# EAGLE design 140311_AriloTX_REV2_0_0 (EAGLE 6.4)
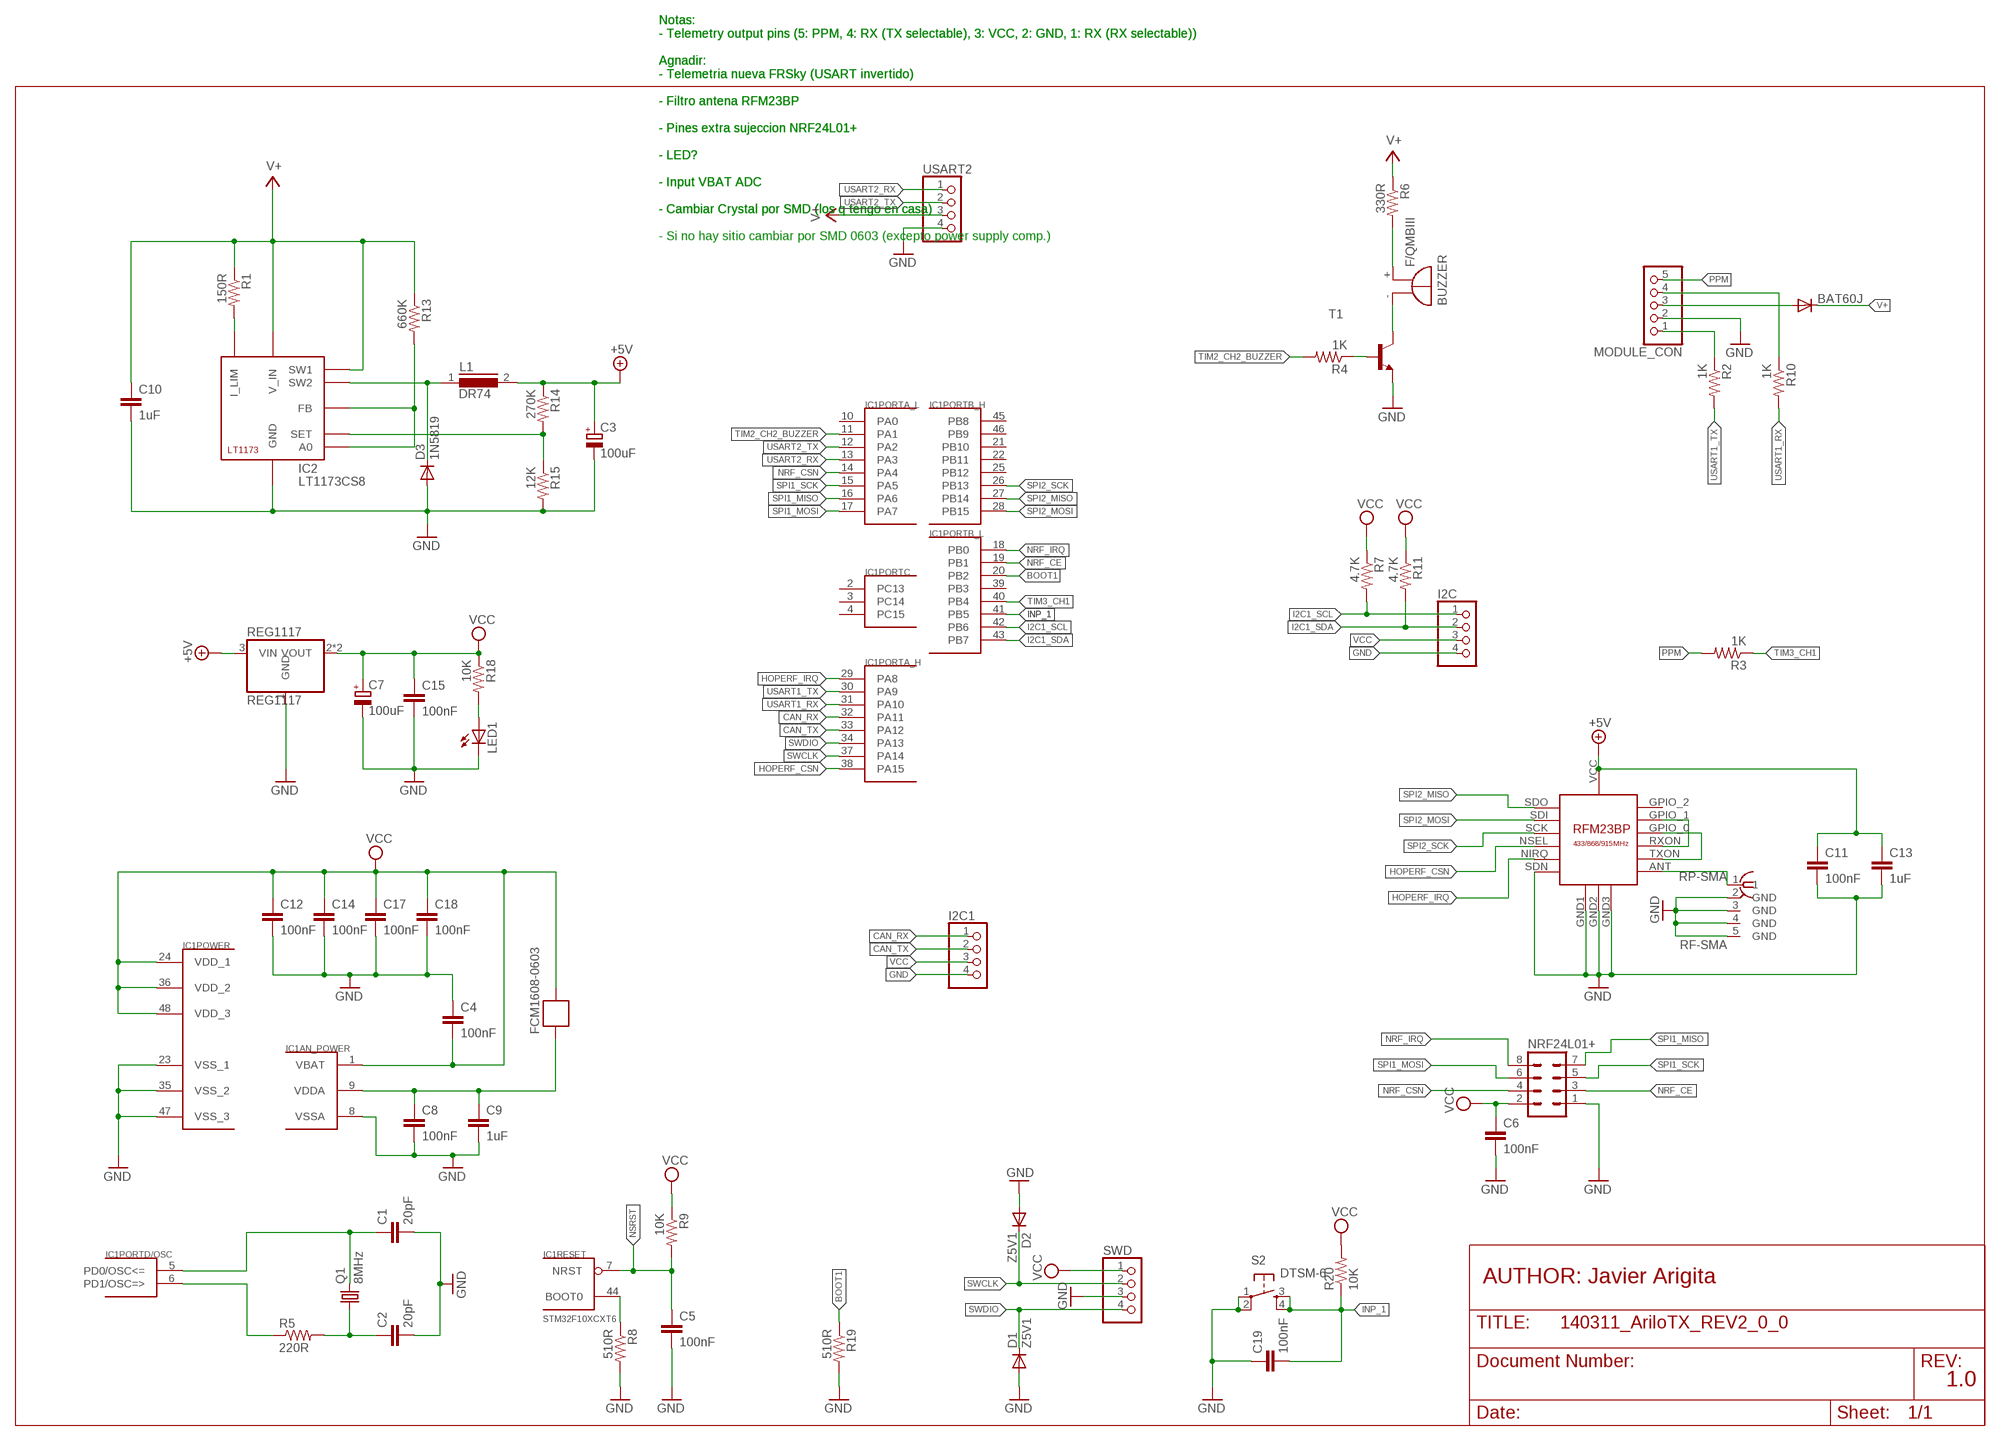
[diagram p0: schematic, sheet 1]

## Parts
BAT60J  DIODE-SOD323-R  [SOD323-R]
BUZZER  F/QMBIII  [F/QMBIII]
C1  20pF  C-EUC0805  [C0805]
C2  20pF  C-EUC0805  [C0805]
C3  100uF  CPOL-EUSMCB  [SMC_B]
C4  100nF  C-EUC0805  [C0805]
C5  100nF  C-EUC0805  [C0805]
C6  100nF  C-EUC0805  [C0805]
C7  100uF  CPOL-EUSMCB  [SMC_B]
C8  100nF  C-EUC0805  [C0805]
C9  1uF  C-EUC3216  [C3216]
C10  1uF  C-EUC3216  [C3216]
C11  100nF  C-EUC0805  [C0805]
C12  100nF  C-EUC0805  [C0805]
C13  1uF  C-EUC3216  [C3216]
C14  100nF  C-EUC0805  [C0805]
C15  100nF  C-EUC0805  [C0805]
C17  100nF  C-EUC0805  [C0805]
C18  100nF  C-EUC0805  [C0805]
C19  100nF  C-EUC0805  [C0805]
D1  Z5V1  DIODE-SOD323-R  [SOD323-R]
D2  Z5V1  DIODE-SOD323-R  [SOD323-R]
D3  1N5819  DIODE-DO214AC  [DO214AC]
FCM1608-0603  FERRITE-BEAD  [R0603]
I2C  PINHD-1X4  [1X04]
I2C1  PINHD-1X4  [1X04]
IC1  STM32F10XCXT6  [TQFP48]
IC2  LT1173CS8  [SOIC8]
L1  DR74  [DR74]
LED1  LED0805  [CHIPLED_0805]
MODULE_CON  PINHD-1X5  [1X05]
NRF24L01+  MA04-2  [MA04-2]
Q1  8MHz  CRYSTALSM49  [SM49]
R1  150R  RESISTOR0805  [R0805]
R2  1K  RESISTOR0805  [R0805]
R3  1K  RESISTOR0805  [R0805]
R4  1K  RESISTOR0805  [R0805]
R5  220R  RESISTOR0805  [R0805]
R6  330R  RESISTOR0805  [R0805]
R7  4.7K  RESISTOR0805  [R0805]
R8  510R  RESISTOR0805  [R0805]
R9  10K  RESISTOR0805  [R0805]
R10  1K  RESISTOR0805  [R0805]
R11  4.7K  RESISTOR0805  [R0805]
R13  660K  RESISTOR0805  [R0805]
R14  270K  RESISTOR0805  [R0805]
R15  12K  RESISTOR0805  [R0805]
R18  10K  RESISTOR0805  [R0805]
R19  510R  RESISTOR0805  [R0805]
R20  10K  RESISTOR0805  [R0805]
REG1117  REG1117  [SOT223]
RP-SMA  RF-SMA  [BU-SMA-H]
S2  DTSM-6  [DTSM-6]
SWD  PINHD-1X4  [1X04]
T1  BC848-NPN-SOT23-BEC  [SOT23-BEC]
U$1  RFM23BP  [RFM23BP]
USART2  PINHD-1X4  [1X04]

## Nets
+5V: C3.+ C11.1 C13.1 L1.2 R14.1 REG1117.3(VIN) U$1.VCC
BOOT1: IC1.20(PORTB_L:PB2) R19.1
CAN_RX: I2C1.1 IC1.32(PORTA_H:PA11)
CAN_TX: I2C1.2 IC1.33(PORTA_H:PA12)
GND: C1.2 C2.2 C3.- C4.1 C5.2 C6.2 C7.- C8.2 C9.2 C10.2 C11.2 C12.2 C13.2 C14.2 C15.2 C17.2 C18.2 C19.1 D1.A D2.A D3.A I2C1.4 I2C.4 IC1.8(AN_POWER:VSSA) IC1.23(POWER:VSS_1) IC1.35(POWER:VSS_2) IC1.47(POWER:VSS_3) IC2.5(GND) LED1.C MODULE_CON.2 NRF24L01+.1 R8.2 R15.2 R19.2 REG1117.1(GND) RP-SMA.2(GND) RP-SMA.3(GND) RP-SMA.4(GND) RP-SMA.5(GND) S2.1 S2.2 SWD.3 T1.E U$1.GND1 U$1.GND2 U$1.GND3 U$1.SDN USART2.4
HOPERF_CSN: IC1.38(PORTA_H:PA15) U$1.NSEL
HOPERF_IRQ: IC1.29(PORTA_H:PA8) U$1.NIRQ
I2C1_SCL: I2C.1 IC1.42(PORTB_L:PB6) R7.2
I2C1_SDA: I2C.2 IC1.43(PORTB_L:PB7) R11.2
INP_1: C19.2 IC1.41(PORTB_L:PB5) R20.1 S2.3 S2.4
N$1: C1.1 IC1.5(PORTD/OSC:PD0/OSC<=) Q1.2
N$2: IC1.6(PORTD/OSC:PD1/OSC=>) R5.1
N$3: C2.1 Q1.1 R5.2
N$4: IC1.44(RESET:BOOT0) R8.1
N$6: MODULE_CON.1 R2.1
N$9: MODULE_CON.4 R10.1
N$10: LED1.A R18.2
N$14: BAT60J.A MODULE_CON.3
N$16: BUZZER.+(-) R6.2
N$17: C8.1 C9.1 FCM1608-0603.2 IC1.9(AN_POWER:VDDA)
N$20: RP-SMA.1 U$1.ANT
N$21: R4.1 T1.B
N$23: BUZZER.-(+) T1.C
N$25: U$1.GPIO_1 U$1.RXON
N$26: U$1.GPIO_0 U$1.TXON
N$28: IC2.1(I_LIM) R1.2
N$29: IC2.6(A0) IC2.8(FB) R13.2
N$31: D3.C IC2.4(SW2) L1.1
N$32: IC2.7(SET) R14.2 R15.1
NRF_CE: IC1.19(PORTB_L:PB1) NRF24L01+.3
NRF_CSN: IC1.14(PORTA_L:PA4) NRF24L01+.4
NRF_IRQ: IC1.18(PORTB_L:PB0) NRF24L01+.8
NSRST: C5.1 IC1.7(RESET:NRST) R9.2
PPM: MODULE_CON.5 R3.2
SPI1_MISO: IC1.16(PORTA_L:PA6) NRF24L01+.7
SPI1_MOSI: IC1.17(PORTA_L:PA7) NRF24L01+.6
SPI1_SCK: IC1.15(PORTA_L:PA5) NRF24L01+.5
SPI2_MISO: IC1.27(PORTB_H:PB14) U$1.SDO
SPI2_MOSI: IC1.28(PORTB_H:PB15) U$1.SDI
SPI2_SCK: IC1.26(PORTB_H:PB13) U$1.SCK
SWCLK: D2.C IC1.37(PORTA_H:PA14) SWD.2
SWDIO: D1.C IC1.34(PORTA_H:PA13) SWD.4
TIM2_CH2_BUZZER: IC1.11(PORTA_L:PA1) R4.2
TIM3_CH1: IC1.40(PORTB_L:PB4) R3.1
USART1_RX: IC1.31(PORTA_H:PA10) R10.2
USART1_TX: IC1.30(PORTA_H:PA9) R2.2
USART2_RX: IC1.13(PORTA_L:PA3) USART2.1
USART2_TX: IC1.12(PORTA_L:PA2) USART2.2
V+: BAT60J.C C10.1 IC2.2(V_IN) IC2.3(SW1) R1.1 R6.1 R13.1 USART2.3
VCC: C4.2 C6.1 C7.+ C12.1 C14.1 C15.1 C17.1 C18.1 FCM1608-0603.1 I2C1.3 I2C.3 IC1.1(AN_POWER:VBAT) IC1.24(POWER:VDD_1) IC1.36(POWER:VDD_2) IC1.48(POWER:VDD_3) NRF24L01+.2 R7.1 R9.1 R11.1 R18.1 R20.2 REG1117.2(VOUT) REG1117.4(VOUT) SWD.1
Unconnected: IC1.2(PORTC:PC13) IC1.3(PORTC:PC14) IC1.4(PORTC:PC15) IC1.10(PORTA_L:PA0) IC1.21(PORTB_H:PB10) IC1.22(PORTB_H:PB11) IC1.25(PORTB_H:PB12) IC1.39(PORTB_L:PB3) IC1.45(PORTB_H:PB8) IC1.46(PORTB_H:PB9) U$1.GPIO_2

## Notes on the sheet
- Notas:
  - Telemetry output pins (5: PPM, 4: RX (TX selectable), 3: VCC, 2: GND, 1: RX (RX selectable))
  
  Agnadir:
  - Telemetria nueva FRSky (USART invertido)
  
  - Filtro antena RFM23BP
  
  - Pines extra sujeccion NRF24L01+
  
  - LED?
  
  - Input VBAT ADC
  
  - Cambiar Crystal por SMD (los q tengo en casa)
  
  - Si no hay sitio cambiar por SMD 0603 (excepto power supply comp.)
- Notas:
  - Telemetry output pins (5: PPM, 4: RX (TX selectable), 3: VCC, 2: GND, 1: RX (RX selectable))
  
  Agnadir:
  - Telemetria nueva FRSky (USART invertido)
  
  - Filtro antena RFM23BP
  
  - Pines extra sujeccion NRF24L01+
  
  - LED?
  
  - Input VBAT ADC
  
  - Cambiar Crystal por SMD (los q tengo en casa)
- AUTHOR: Javier Arigita
- 1.0

## Library data of the parts
BAT60J D1-D3 = diode:DIODE-: DIODE
BUZZER = buzzer:F/QMBIII: BUZZER Source: Buerklin; OC_FARNELL: unknown; OC_NEWARK: unknown
C1 C2 C4-C6 C8 C11 C12 C14 C15 C17-C19 = rcl:C-EU: CAPACITOR, European symbol
C3 C7 = rcl:CPOL-EU: POLARIZED CAPACITOR, European symbol
C9 C10 C13 = resistor:C-EU: CAPACITOR, European symbol
FCM1608-0603 = BaseApp:FERRITE-BEAD
I2C I2C1 SWD USART2 = pinhead:PINHD-1X4: PIN HEADER
IC1 = stm32:STM32F10XCXT6: ST STM32F101/103 48pin LQFP
IC2 = ltc_swr:LT1173: LT1173 - Micropower DC/DC Converter Adjustable and Fixed 5V, 12V Operates at Supply Voltages From 2.0V to 30V Consumes Only 110µA Supply Current Works in Step-Up or Step-Down Mode Only Three External Components Required Low Battery Detector Comparator On-Chip User-Adjustable Current Limit Internal 1A Power Switch Fixed or Adjustable Output Voltage Versions Space Saving 8-Pin MiniDIP or SO8 Package
L1 = inductors:DR74: High Power Density, High Efficiency, Shielded Inductors Source: coiltronics_dr_series.pdf
LED1 = CEDT:LED
MODULE_CON = pinhead:PINHD-1X5: PIN HEADER
NRF24L01+ = con-lstb:MA04-2: PIN HEADER; OC_FARNELL: unknown; OC_NEWARK: unknown
Q1 = crystal:CRYSTAL: CRYSTAL; OC_FARNELL: unknown; OC_NEWARK: unknown
R1-R11 R13-R15 R18-R20 = CEDT:RESISTOR
REG1117 = CEDT:REG1117: 800mA and 1A Low Dropout (LDO) Positive Regulator 1.8V, 2.5V, 2.85V, 3.3V, 5V, and Adj
RP-SMA = BaseApp:RF-SMA
S2 = switch-tact:DTSM-6
T1 = transistor:*-NPN-: NPN Transistror BF959 corrected 2008.03.06
U$1 = RFM23BP:RFM23BP: HopeRF RFM23BP Library by: http://projects.weber-itam.de

## Board
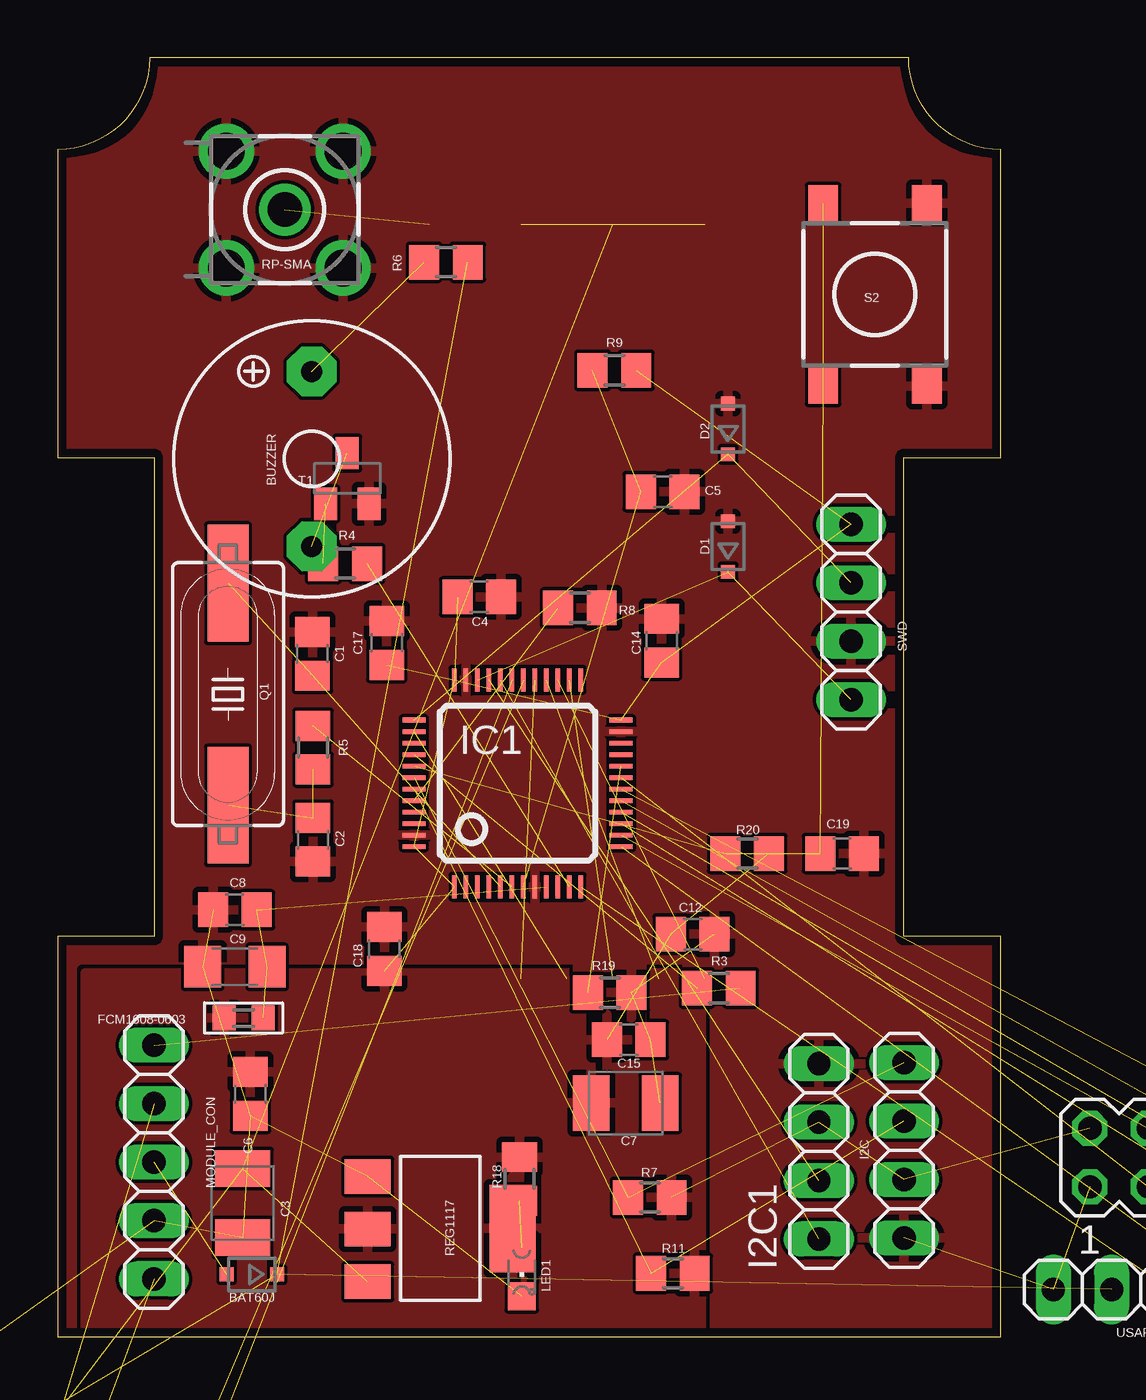
[diagram p1: board, top side]
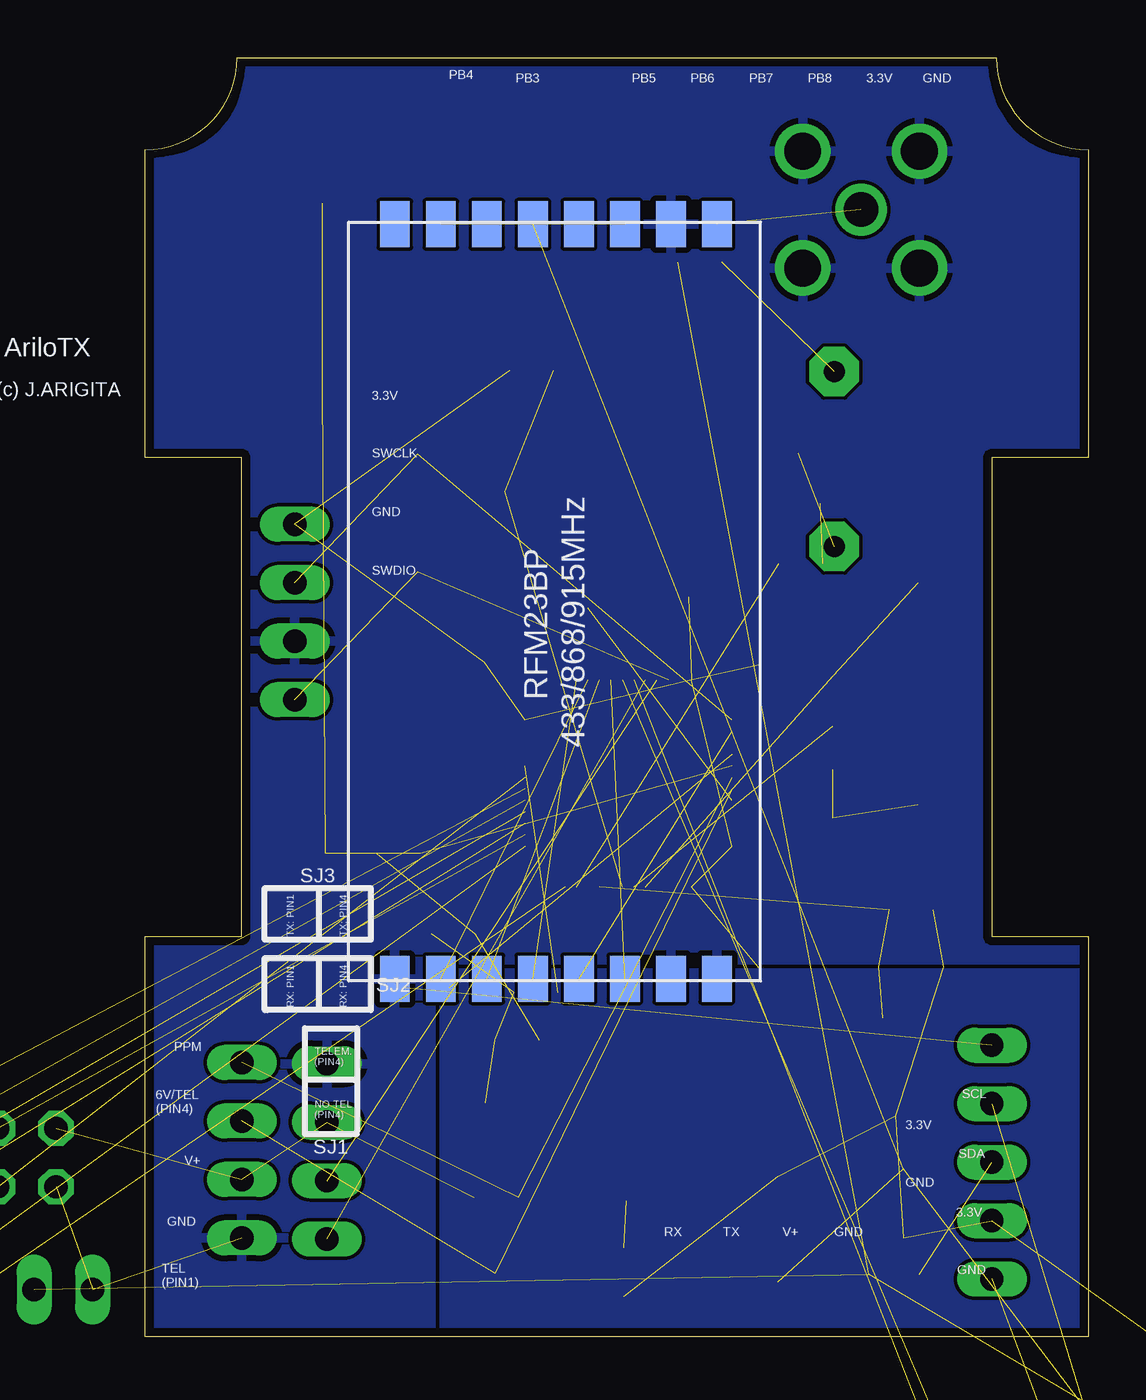
[diagram p2: board, bottom side, seen from below]

Size 41 x 55.6 mm. Coordinates in mm from the lower left corner, seen from the top.
Outline: 0,0 41,0 41,17.4 36.8,17.4 36.8,38.2 41,38.2 41,51.6 arc-90 37,55.6 4,55.6 arc-90 0,51.6 0,38.2 4.2,38.2 4.2,17.4 0,17.4 0,0
Copper layers (1*16): Top 0.0356mm / dielectric 1.5011mm / Bottom 0.0356mm
Design rules "LaenPCBOrder": minimum track width 6mil, minimum drill 13mil, track to track 6mil, track to pad 6mil, pad to pad 6mil, via to via 6mil, smd to smd 6mil, copper to edge 15mil, drill to drill 6mil, minimum pad ring 7mil, minimum via ring 7mil, stop-mask expansion 4mil, vias tented up to drill 0mil, thermal gap 10mil

### Footprints (pad centres in the part's own frame; a part is rotated, then mirrored left to right if it is on the bottom)
SOD323-R = smd 0.6 x 0.6: A 1.1,0; C -1.1,0
F/QMBIII = drill 0.914 pad 2.159 octagon: + 3.8,0; - -3.8,0
C0805 = smd 1.3 x 1.5: 1 -0.95,0; 2 0.95,0
SMC_B = smd 1.6 x 2.4: + -1.5,0; - 1.5,0
C3216 = smd 1.6 x 1.8: 1 -1.4,0; 2 1.4,0
DO214AC = smd 1.8 x 1.7: A 2.05,0; C -2.05,0
R0603 = smd 1 x 1.1: 1 -0.85,0; 2 0.85,0
1X04 = drill 1.016 long: 1 -3.81,0; 2 -1.27,0; 3 1.27,0; 4 3.81,0
TQFP48 = smd 0.2 x 1: 1 -2.75,-4.5; 2 -2.25,-4.5; 3 -1.75,-4.5; 4 -1.25,-4.5; 5 -0.75,-4.5; 6 -0.25,-4.5; 7 0.25,-4.5; 8 0.75,-4.5; 9 1.25,-4.5; 10 1.75,-4.5; 11 2.25,-4.5; 12 2.75,-4.5; 25 2.75,4.5; 26 2.25,4.5; 27 1.75,4.5; 28 1.25,4.5; 29 0.75,4.5; 30 0.25,4.5; 31 -0.25,4.5; 32 -0.75,4.5; 33 -1.25,4.5; 34 -1.75,4.5; 35 -2.25,4.5; 36 -2.75,4.5 | smd 1 x 0.2: 13 4.5,-2.75; 14 4.5,-2.25; 15 4.5,-1.75; 16 4.5,-1.25; 17 4.5,-0.75; 18 4.5,-0.25; 19 4.5,0.25; 20 4.5,0.75; 21 4.5,1.25; 22 4.5,1.75; 23 4.5,2.25; 24 4.5,2.75; 37 -4.5,2.75; 38 -4.5,2.25; 39 -4.5,1.75; 40 -4.5,1.25; 41 -4.5,0.75; 42 -4.5,0.25; 43 -4.5,-0.25; 44 -4.5,-0.75; 45 -4.5,-1.25; 46 -4.5,-1.75; 47 -4.5,-2.25; 48 -4.5,-2.75
SOIC8 = smd 0.6 x 2.2: 1 -1.905,-2.6; 2 -0.635,-2.6; 3 0.635,-2.6; 4 1.905,-2.6; 5 1.905,2.6; 6 0.635,2.6; 7 -0.635,2.6; 8 -1.905,2.6
DR74 = smd 2.5 x 3.25: 1 -3,0; 2 3,0
CHIPLED_0805 = smd 1.2 x 1.2: A 0,-1.05; C 0,1.05
1X05 = drill 1.016 long: 1 -5.08,0; 2 -2.54,0; 3 0,0; 4 2.54,0; 5 5.08,0
MA04-2 = drill 1.016 octagon: 1 -3.81,-1.27; 2 -3.81,1.27; 3 -1.27,-1.27; 4 -1.27,1.27; 5 1.27,-1.27; 6 1.27,1.27; 7 3.81,-1.27; 8 3.81,1.27
SM49 = smd 5.08 x 1.778: 1 -4.826,0; 2 4.826,0
R0805 = smd 1.3 x 1.5: 1 -0.95,0; 2 0.95,0
SOT223 = smd 1.499 x 2.007: 1 -2.261,-3.15; 2 0.025,-3.15; 3 2.311,-3.15 | smd 3.81 x 2.007: 4 0,3.15
BU-SMA-H = drill 1.5: 1 0,0 | drill 1.6: 2 -2.54,2.54; 3 2.54,2.54; 4 2.54,-2.54; 5 -2.54,-2.54
DTSM-6 = smd 1.55 x 1.3: 1 -3.975,2.25; 2 3.975,2.25; 3 -3.975,-2.25; 4 3.975,-2.25
SOT23-BEC = smd 1 x 1.4: B -0.95,-1.1; C 0,1.1; E 0.95,-1.1
RFM23BP = smd 2 x 1.3: ANT 16.9,-7.5; GND1 -15.9,6.5; GND2 -15.9,-7.5; GND3 16.9,-5.5; GPIO_0 16.9,2.5; GPIO_1 16.9,4.5; GPIO_2 16.9,6.5; NIRQ -15.9,-3.5; NSEL -15.9,-1.5; RXON 16.9,-1.5; SCK -15.9,0.5; SDI -15.9,2.5; SDN -15.9,-5.5; SDO -15.9,4.5; TXON 16.9,-3.5; VCC 16.9,0.5

### Placement (x,y rotation side)
BAT60J  8.45,2.7 180 top
BUZZER  11.05,38.15 90 top
C1  11.09,29.68 90 top
C2  11.11,21.6 270 top
C3  8.05,5.8 270 top
C4  18.34,32.15 180 top
C5  26.31,36.73 0 top
C6  8.38,10.55 270 top
C7  24.7,10.15 0 top
C8  7.71,18.55 180 top
C9  7.71,16.07 180 top
C10  -8.3,-10.45 0 top  (outside the outline)
C11  -17.55,-46.6 0 top  (outside the outline)
C12  27.61,17.5 0 top
C13  -17.05,-52.5 0 top  (outside the outline)
C14  26.26,30.25 90 top
C15  24.84,12.9 0 top
C17  14.31,30.15 90 top
C18  14.21,16.85 90 top
C19  34.11,21 180 top
D1  29.15,34.34 90 top
D2  29.15,39.45 90 top
D3  -16.4,-28.45 0 top  (outside the outline)
FCM1608-0603  8.09,13.85 0 top
I2C  36.8,8.1 270 top
I2C1  33.1,8.05 90 top
IC1  20,24.05 0 top
IC2  -6.45,-3.8 0 top  (outside the outline)
L1  -15.2,-19.4 0 top  (outside the outline)
LED1  20.18,2.8 180 top
MODULE_CON  4.19,7.58 90 top
NRF24L01+  48.69,7.78 0 top  (outside the outline)
Q1  7.41,27.93 90 top
R1  -8.8,-16.35 0 top  (outside the outline)
R2  -17.55,-58.4 0 top  (outside the outline)
R3  28.75,15.15 0 top
R4  12.5,33.6 0 top
R5  11.11,25.6 270 top
R6  16.89,46.7 180 top
R7  25.75,6.05 180 top
R8  22.71,31.68 0 top
R9  24.21,42 180 top
R10  -17.55,-64.45 0 top  (outside the outline)
R11  26.75,2.75 180 top
R13  -8.8,-22.4 0 top  (outside the outline)
R14  -17.55,-34.5 0 top  (outside the outline)
R15  -17.55,-40.55 0 top  (outside the outline)
R18  20.09,6.85 270 top
R19  24.01,14.95 0 top
R20  29.98,21 0 top
REG1117  16.64,4.7 270 top
RP-SMA  9.88,48.99 180 top
S2  35.53,45.3 270 top
SWD  34.5,31.5 270 top
T1  12.6,37.3 0 top
U$1  23.65,31.45 90 bottom
USART2  47.1,2.05 180 top

### Tracks (layer width: path | path; a pad name or v marks a point on that pad's centre or on a via)
+5V  (6 unrouted)
BOOT1  (1 unrouted)
CAN_RX  (1 unrouted)
CAN_TX  (1 unrouted)
GND  (17 unrouted)
  pour Top (rank 2): 40.5,16.9 36.3,17 36.3,38.7 40.5,38.7 40.5,42.5 40.5,44.5 40.5,51.1 arc-90 36.5,55.1 33.5,55.1 31.5,55.1 9.5,55.1 7.5,55.1 4.5,55.1 arc-90 0.5,51.1 0.5,38.7 4.7,38.7 4.7,16.9 0.5,16.9 0.5,0.5 40.5,0.5
  pour Bottom (rank 2): 40.5,16.9 36.3,17 36.3,38.7 40.5,38.7 40.5,51.1 arc-90 36.5,55.1 4.5,55.1 arc-90 0.5,51.1 0.5,38.7 4.7,38.7 4.7,16.9 0.5,16.9 0.5,0.5 40.5,0.5
HOPERF_CSN  (1 unrouted)
HOPERF_IRQ  (1 unrouted)
I2C1_SCL  (2 unrouted)
I2C1_SDA  (2 unrouted)
INP_1  (4 unrouted)
N$1  (2 unrouted)
N$2  (1 unrouted)
N$3  (2 unrouted)
N$4  (1 unrouted)
N$6  (1 unrouted)
N$9  (1 unrouted)
N$10  (1 unrouted)
N$14  (1 unrouted)
N$16  (1 unrouted)
N$17  (3 unrouted)
N$20  (1 unrouted)
N$21  (1 unrouted)
N$23  (1 unrouted)
N$25  (1 unrouted)
N$26  (1 unrouted)
N$28  (1 unrouted)
N$29  (2 unrouted)
N$31  (2 unrouted)
N$32  (2 unrouted)
NRF_CE  (1 unrouted)
NRF_CSN  (1 unrouted)
NRF_IRQ  (1 unrouted)
NSRST  (2 unrouted)
PPM  (1 unrouted)
SPI1_MISO  (1 unrouted)
SPI1_MOSI  (1 unrouted)
SPI1_SCK  (1 unrouted)
SPI2_MISO  (1 unrouted)
SPI2_MOSI  (1 unrouted)
SPI2_SCK  (1 unrouted)
SWCLK  (2 unrouted)
SWDIO  (2 unrouted)
TIM2_CH2_BUZZER  (1 unrouted)
TIM3_CH1  (1 unrouted)
USART1_RX  (1 unrouted)
USART1_TX  (1 unrouted)
USART2_RX  (1 unrouted)
USART2_TX  (1 unrouted)
V+  (7 unrouted)
VCC  (14 unrouted)
  pour Bottom: 28,0.4 0.4,0.4 0.4,15.8 28,15.8
  pour Bottom: 28,0.4 1.2,0.4 1.2,15.8 28,15.8
  pour Top: 28,0.4 1.2,0.4 1.2,15.8 28,15.8

### Text on the board
bPlace: PB4 | GND | 3.3V | PB8 | PB7 | PB6 | PB5 | PB3 | AriloTX | 3.3V | (c) J.ARIGITA | SWCLK | GND | SWDIO | SJ3 | TX: PIN4 | TX: PIN1 | SJ2 | RX: PIN4 | RX: PIN1 | TELEM. / (PIN4) | PPM | SCL | NO TEL / (PIN4) | 6V/TEL / (PIN4) | 3.3V | SDA | SJ1 | V+ | GND | 3.3V | GND | GND | V+ | TX | RX | GND | TEL / (PIN1)